# Altium schematic sheet 遥控器.SchDoc
size A3
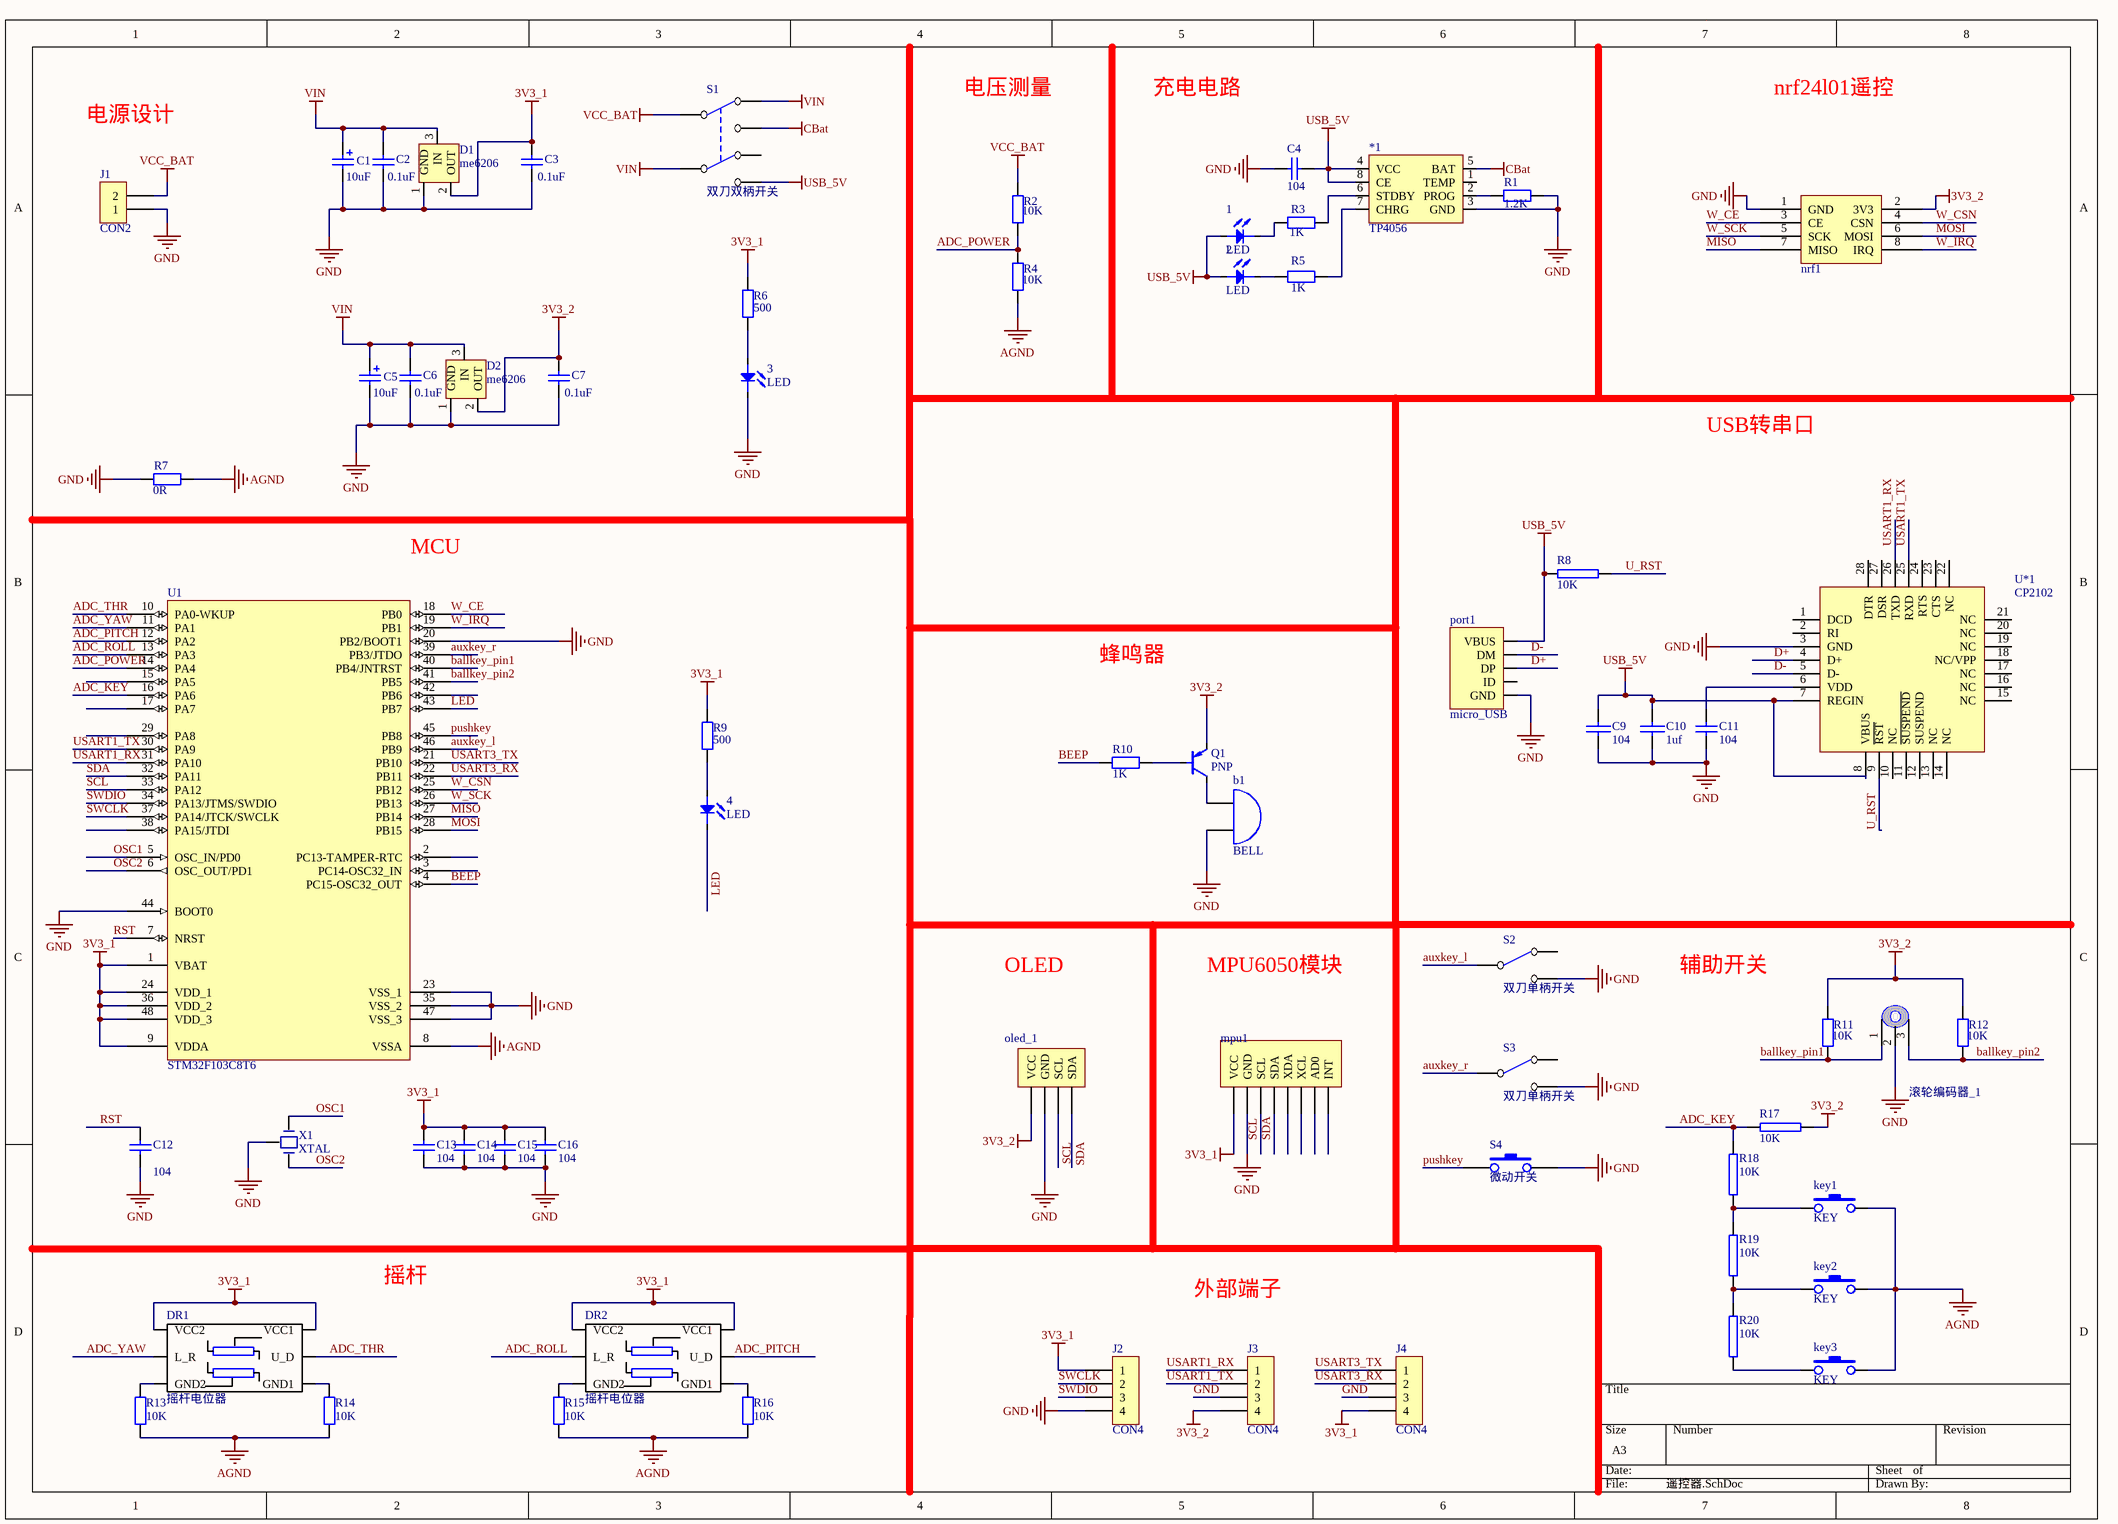
[diagram p0: 遥控器.SchDoc]

## Parts
1  LED  [LC-0603_LED_S3]
2  LED  [LC-0603_LED_S3]
3  LED  [LC-0603_LED_S3]
4  LED  [LC-0603_LED_S3]
*1  TP4056  [LC-SOP-8_EP_150mil]
b1  BELL  [bell_d5]
C1  value 10uF  [LC-0603_C]  (hidden comment: Cap Pol2)
C2  value 0.1uF  [LC-0603_C]  (hidden comment: Cap)
C3  value 0.1uF  [LC-0603_C]  (hidden comment: Cap)
C4  value 104  [LC-0603_C]  (hidden comment: Cap)
C5  value 10uF  [LC-0603_C]  (hidden comment: Cap Pol2)
C6  value 0.1uF  [LC-0603_C]  (hidden comment: Cap)
C7  value 0.1uF  [LC-0603_C]  (hidden comment: Cap)
C9  104  [LC-0603_C]
C10  1uf  [LC-0603_C]
C11  value 104  [LC-0603_C]  (hidden comment: Cap)
C12  value 104  [LC-0603_C]  (hidden comment: Cap)
C13  value 104  [LC-0603_C]  (hidden comment: Cap)
C14  value 104  [LC-0603_C]  (hidden comment: Cap)
C15  value 104  [LC-0603_C]  (hidden comment: Cap)
C16  value 104  [LC-0603_C]  (hidden comment: Cap)
D1  me6206  [LC-SOT-23(SOT-23-3)]
D2  me6206  [LC-SOT-23(SOT-23-3)]
DR1  摇杆电位器  [摇杆电位器]
DR2  摇杆电位器  [摇杆电位器]
J1  CON2  [SIP2]
J2  CON4  [SIP4]
J3  CON4  [SIP4]
J4  CON4  [SIP4]
key1  KEY  [贴片按键6.1x3.7]
key2  KEY  [贴片按键6.1x3.7]
key3  KEY  [贴片按键6.1x3.7]
mpu1  CON8  [MPU6050模块]  (value not drawn)
nrf1  nrf24l01  [nrf模块（带天线）]  (value not drawn)
oled_1  CON4  [oled_i2c_0.96]  (value not drawn)
port1  micro_USB  [MICRO-USB]
Q1  PNP  [LC-SC-70-6(SOT-363)]
R1  value 1.2K  [LC-0603_R]  (hidden comment: Res2)
R2  value 10K  [LC-0603_R]  (hidden comment: Res2)
R3  value 1K  [LC-0603_R]  (hidden comment: Res2)
R4  value 10K  [LC-0603_R]  (hidden comment: Res2)
R5  value 1K  [LC-0603_R]  (hidden comment: Res2)
R6  value 500  [LC-0603_R]  (hidden comment: Res2)
R7  value 0R  [LC-0603_R]  (hidden comment: Res2)
R8  10K  [LC-0603_R]
R9  value 500  [LC-0603_R]  (hidden comment: Res2)
R10  value 1K  [LC-0603_R]  (hidden comment: Res2)
R11  value 10K  [LC-0603_R]  (hidden comment: Res2)
R12  value 10K  [LC-0603_R]  (hidden comment: Res2)
R13  value 10K  [LC-0603_R]  (hidden comment: Res2)
R14  value 10K  [LC-0603_R]  (hidden comment: Res2)
R15  value 10K  [LC-0603_R]  (hidden comment: Res2)
R16  value 10K  [LC-0603_R]  (hidden comment: Res2)
R17  10K  [LC-0603_R]
R18  10K  [LC-0603_R]
R19  10K  [LC-0603_R]
R20  10K  [LC-0603_R]
S1  双刀双柄开关  [开关双联六脚]
S2  双刀单柄开关  [二段开关8x5mm]
S3  双刀单柄开关  [二段开关8x5mm]
S4  微动开关  [微动开关]
U1  STM32F103C8T6  [LQFP48_N]
U*1  CP2102  [LC-QFN-28_5x5x05P]
X1  XTAL  [三脚晶振]
滚轮编码器_1  滚轮编码器_7mm  [滚轮编码器]  (value not drawn)

## Nets
3V3_1: C3.1 C13.1 C14.1 C15.1 C16.1 D1.2(OUT) DR1.1(VCC1) DR1.4(VCC2) DR2.1(VCC1) DR2.4(VCC2) J2.1 J4.4 mpu1.1(VCC) R6.2 R9.2 U1.1(VBAT) U1.9(VDDA) U1.24(VDD_1) U1.36(VDD_2) U1.48(VDD_3)
3V3_2: C7.1 D2.2(OUT) J3.4 nrf1.2(3V3) oled_1.1(VCC) Q1.1(e) R11.2 R12.2 R17.1
AGND: key1.2 key2.2 key3.2 R4.1 R7.2 R13.2 R14.2 R15.2 R16.2 U1.8(VSSA)
CBat: *1.5(BAT) S1.3(NO1)
GND: 3.K *1.3(GND) b1.2 C1.2 C2.2 C3.2 C4.2 C5.2 C6.2 C7.2 C9.2 C10.1 C11.1 C12.2 C13.2 C14.2 C15.2 C16.2 D1.1(GND) D2.1(GND) J1.1 J2.4 J3.3 J4.3 mpu1.2(GND) nrf1.1(GND) oled_1.2(GND) port1.5(GND) R1.1 R7.1 S2.3(NO) S3.3(NO) S4.2 U1.20(PB2/BOOT1) U1.23(VSS_1) U1.35(VSS_2) U1.44(BOOT0) U1.47(VSS_3) U*1.3(GND) X1.3 滚轮编码器_1.2
USB_5V: 1.A 2.A *1.4(VCC) *1.8(CE) C4.1 C9.1 C10.2 port1.1(VBUS) R8.1 S1.6(NO2) U*1.7(REGIN) U*1.8(VBUS)
VCC_BAT: J1.2 R2.2 S1.1(COMMON1)
VIN: C1.1 C2.1 C5.1 C6.1 D1.3(IN) D2.3(IN) S1.2(NC1) S1.5(COMMON2)
ADC_KEY: R17.2 R18.2 U1.16(PA6)
ADC_PITCH: DR2.2(U_D) U1.12(PA2)
ADC_POWER: R2.1 R4.2 U1.14(PA4)
ADC_ROLL: DR2.5(L_R) U1.13(PA3)
ADC_THR: DR1.2(U_D) U1.10(PA0-WKUP)
ADC_YAW: DR1.5(L_R) U1.11(PA1)
auxkey_l: S2.1(COMMON) U1.46(PB9)
auxkey_r: S3.1(COMMON) U1.39(PB3/JTDO)
ballkey_pin1: R11.1 U1.40(PB4/JNTRST) 滚轮编码器_1.1
ballkey_pin2: R12.1 U1.41(PB5) 滚轮编码器_1.3
BEEP: R10.2 U1.4(PC15-OSC32_OUT)
D+: port1.3(DP) U*1.4(D+)
D-: port1.2(DM) U*1.5(D-)
LED: 4.K U1.43(PB7)
MISO: nrf1.7(MISO) U1.27(PB14)
MOSI: nrf1.6(MOSI) U1.28(PB15)
OSC1: U1.5(OSC_IN/PD0) X1.1
OSC2: U1.6(OSC_OUT/PD1) X1.2
pushkey: S4.1 U1.45(PB8)
RST: C12.1 U1.7(NRST)
SCL: mpu1.3(SCL) oled_1.3(SCL) U1.33(PA12)
SDA: mpu1.4(SDA) oled_1.4(SDA) U1.32(PA11)
SWCLK: J2.2 U1.37(PA14/JTCK/SWCLK)
SWDIO: J2.3 U1.34(PA13/JTMS/SWDIO)
U_RST: R8.2 U*1.9(~{RST})
USART1_RX: J3.1 U1.31(PA10) U*1.26(TXD)
USART1_TX: J3.2 U1.30(PA9) U*1.25(RXD)
USART3_RX: J4.2 U1.22(PB11)
USART3_TX: J4.1 U1.21(PB10)
W_CE: nrf1.3(CE) U1.18(PB0)
W_CSN: nrf1.4(CSN) U1.25(PB12)
W_IRQ: nrf1.8(IRQ) U1.19(PB1)
W_SCK: nrf1.5(SCK) U1.26(PB13)
Net1_K: 1.K R3.2
Net2_K: 2.K R5.2
Net3_A: 3.A R6.1
Net4_A: 4.A R9.1
Net*1_2: *1.2(PROG) R1.2
Net*1_6: *1.6(STDBY) R3.1
Net*1_7: *1.7(CHRG) R5.1
Netb1_1: b1.1 Q1.6(c)
NetC11_2: C11.2 U*1.6(VDD)
NetDR1_3: DR1.3(GND1) R14.1
NetDR1_6: DR1.6(GND2) R13.1
NetDR2_3: DR2.3(GND1) R16.1
NetDR2_6: DR2.6(GND2) R15.1
Netkey1_1: key1.1 R18.1 R19.2
Netkey2_1: key2.1 R19.1 R20.2
Netkey3_1: key3.1 R20.1
NetQ1_2: Q1.2(b) R10.1

Not connected (* = marked no-connect by the designer): *1 1(TEMP); mpu1 5(XDA) 6(XCL) 7(AD0) 8(INT); port1 4(ID); S1 4(NC2); S2 2(NC); S3 2(NC); U1 2(PC13-TAMPER-RTC) 3(PC14-OSC32_IN) 15(PA5) 17(PA7) 29(PA8) 38(PA15/JTDI) 42(PB6); U*1 1(DCD) 2(RI) 10(NC) 11(~{SUSPEND}) 12(SUSPEND) 13(NC) 14(NC) 15(NC) 16(NC) 17(NC) 18(NC/VPP) 19(NC) 20(NC) 21(NC) 22(NC) 23(CTS) 24(RTS) 27(DSR) 28(DTR)

## Notes on the sheet
- 电源设计
- 电压测量
- 充电电路
- nrf24l01遥控
- USB转串口
- MCU
- 蜂鸣器
- OLED
- MPU6050模块
- 辅助开关
- 摇杆
- 外部端子

## Library data of the parts
C1 C5 = Cap Pol2: Polarized Capacitor (Axial); Published: 8-Jun-2000; LatestRevisionDate: 17-Jul-2002; LatestRevisionNote: Re-released for DXP Platform.; PackageReference: POLAR0.8; Publisher: Altium Limited; PackageDescription: Polarized Capacitor; 2 Leads
C2-C4 C6 C7 C11-C16 = Cap: Capacitor; Published: 8-Jun-2000; LatestRevisionDate: 17-Jul-2002; LatestRevisionNote: Re-released for DXP Platform.; PackageReference: RAD-0.3; Publisher: Altium Limited; PackageDescription: Radial Cap, Thru-Hole; 2 Leads; 0.3 in Pin Spacing
C9 C10 = CAP
mpu1 = mpu6050模块
oled_1 = oled_0.96_i2c
R1-R7 R9-R16 = Res2: Resistor; Published: 8-Jun-2000; LatestRevisionDate: 17-Jul-2002; LatestRevisionNote: Re-released for DXP Platform.; PackageReference: AXIAL-0.4; Publisher: Altium Limited; PackageDescription: Axial Device, Thru-Hole; 2 Leads; 0.4 in Pin Spacing
R8 R17-R20 = RES
U1 = STM32F103C8T6: STM32 ARM-based 32-bit MCU with 64 Kbytes Flash, 48-pin LQFP, Industrial Temperature; Published: *; DatasheetVersion: *; PackageVersion: *; PackageReference: *; Publisher: *; PackageDescription: *; ComponentLink1Description: *; ComponentLink1URL: *; ComponentLink2Description: *; ComponentLink2URL: *
U*1 = CP2102: USBtoTTL
X1 = XTAL_3P